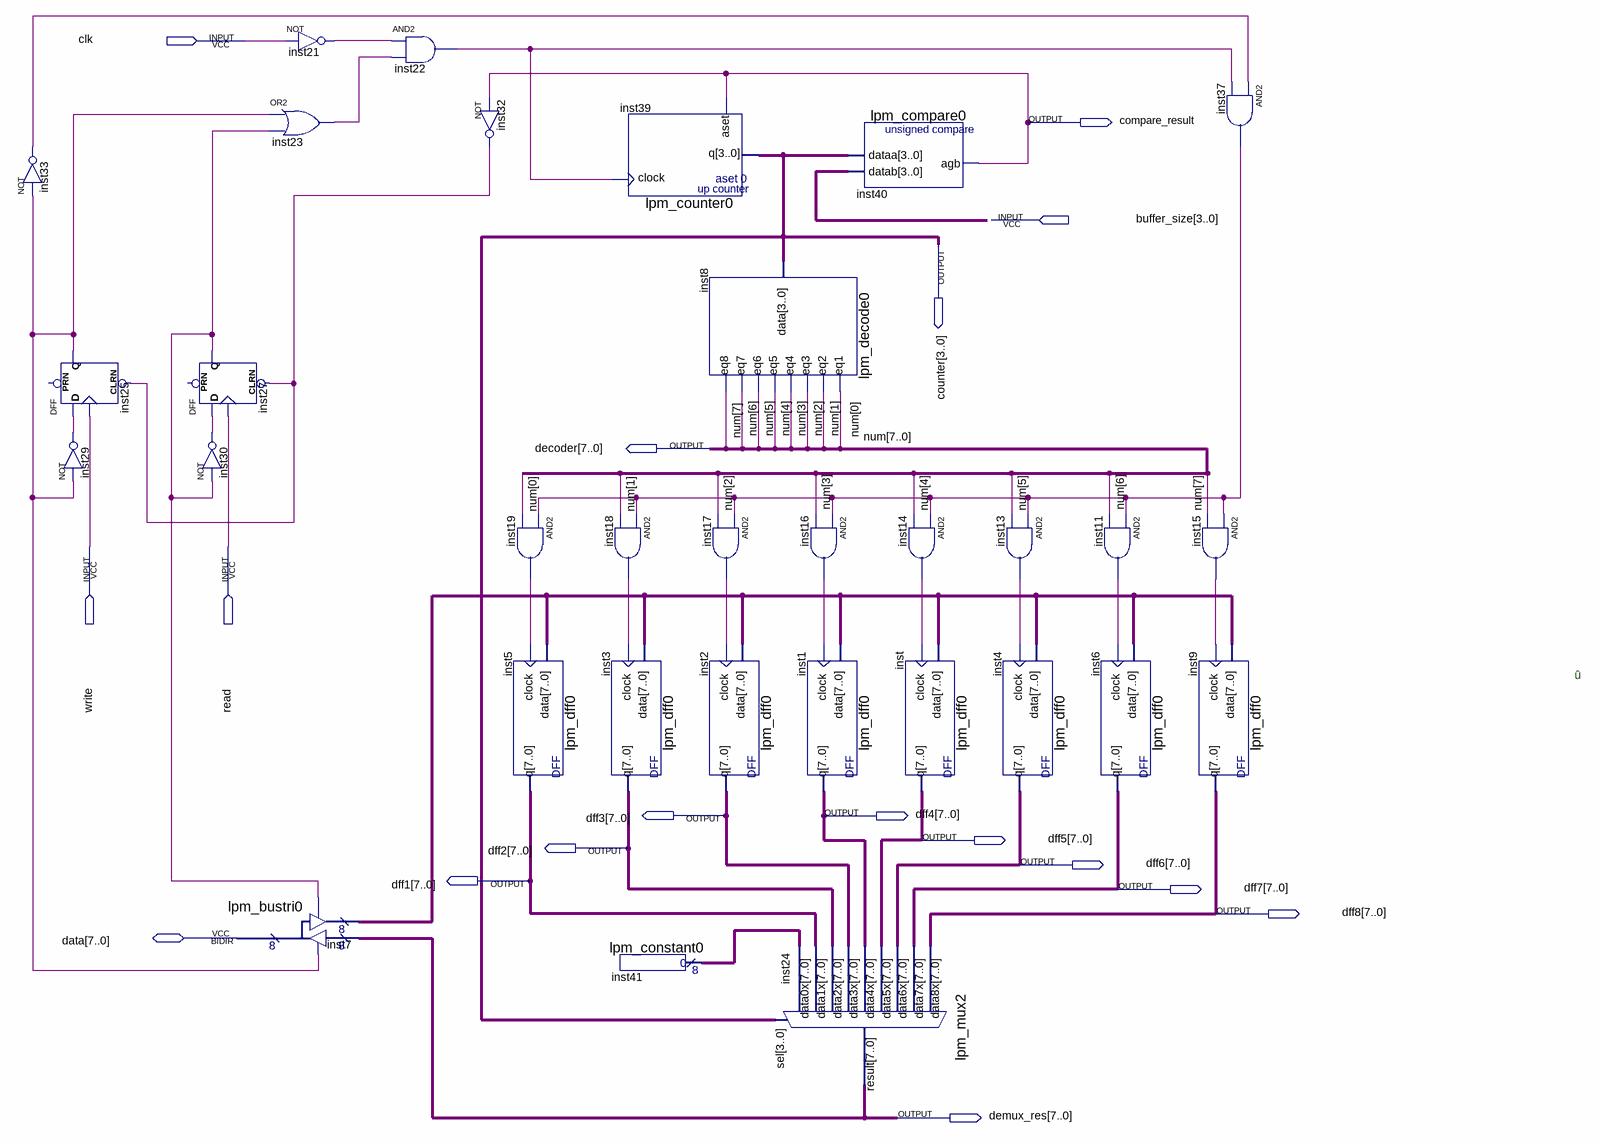
[diagram p0: schematic sheet]
// Quartus schematic Memory.bdf as structural Verilog: 32 symbols, 17 pins
module Memory (
  input  clk,
  input  [3:0] buffer_size,
  input  write,
  input  read,
  inout  [7:0] data,
  output compare_result,
  output [3:0] counter,
  output [7:0] decoder,
  output [7:0] dff3,
  output [7:0] dff4,
  output [7:0] dff5,
  output [7:0] dff2,
  output [7:0] dff6,
  output [7:0] dff1,
  output [7:0] dff7,
  output [7:0] dff8,
  output [7:0] demux_res
);

  wire inst11_out, inst13_out, inst14_out, inst15_out, inst16_out, inst17_out, inst18_out, inst19_out,
       inst21_out, inst22_out, inst23_out, inst25_q, inst27_q, inst29_out, inst30_out, inst32_out,
       inst33_out, inst37_out;
  wire [7:0] inst7_result, inst41_result;

  not inst33 (inst33_out, inst25_q);
  DFF inst25 (.CLRN(inst32_out), .CLK(write), .D(inst29_out), .Q(inst25_q));  // open: PRN
  not inst29 (inst29_out, inst25_q);
  DFF inst27 (.CLRN(inst32_out), .CLK(read), .D(inst30_out), .Q(inst27_q));  // open: PRN
  not inst30 (inst30_out, inst27_q);
  lpm_bustri0 inst7 (.enabledt(inst25_q), .data(demux_res), .enabletr(inst27_q), .result(inst7_result), .tridata(data));
  not inst21 (inst21_out, clk);
  or inst23 (inst23_out, inst25_q, inst27_q);
  and inst22 (inst22_out, inst21_out, inst23_out);
  not inst32 (inst32_out, compare_result);
  and inst19 (inst19_out, inst37_out, decoder[0]);
  lpm_dff0 inst5 (.data(inst7_result), .clock(inst19_out), .q(dff1));
  lpm_counter0 inst39 (.clock(inst22_out), .aset(compare_result), .q(counter));
  and inst18 (inst18_out, inst37_out, decoder[1]);
  lpm_dff0 inst3 (.data(inst7_result), .clock(inst18_out), .q(dff2));
  lpm_constant0 inst41 (.result(inst41_result));
  lpm_decode0 inst8 (
    .data(counter), .eq1(decoder[0]), .eq2(decoder[1]), .eq3(decoder[2]), .eq4(decoder[3]), .eq5(decoder[4]),
    .eq6(decoder[5]), .eq7(decoder[6]), .eq8(decoder[7]));
  and inst17 (inst17_out, inst37_out, decoder[2]);
  lpm_dff0 inst2 (.data(inst7_result), .clock(inst17_out), .q(dff3));
  and inst16 (inst16_out, inst37_out, decoder[3]);
  lpm_dff0 inst1 (.data(inst7_result), .clock(inst16_out), .q(dff4));
  lpm_mux2 inst24 (
    .data8x(dff8), .data7x(dff7), .data6x(dff6), .data5x(dff5), .data4x(dff4), .data3x(dff3), .data2x(dff2),
    .data1x(dff1), .data0x(inst41_result), .sel(counter), .result(demux_res));
  lpm_compare0 inst40 (.dataa(counter), .datab(buffer_size), .agb(compare_result));
  and inst14 (inst14_out, inst37_out, decoder[4]);
  lpm_dff0 inst (.data(inst7_result), .clock(inst14_out), .q(dff5));
  and inst13 (inst13_out, inst37_out, decoder[5]);
  lpm_dff0 inst4 (.data(inst7_result), .clock(inst13_out), .q(dff6));
  and inst11 (inst11_out, inst37_out, decoder[6]);
  lpm_dff0 inst6 (.data(inst7_result), .clock(inst11_out), .q(dff7));
  and inst37 (inst37_out, inst33_out, inst22_out);
  and inst15 (inst15_out, inst37_out, decoder[7]);
  lpm_dff0 inst9 (.data(inst7_result), .clock(inst15_out), .q(dff8));

  // Other names for the same wires on the sheet: num[7:0] = decoder

  // Notes on the sheet:
  //   û
endmodule
